# Altium schematic sheet 放大电路.SchDoc
size A4
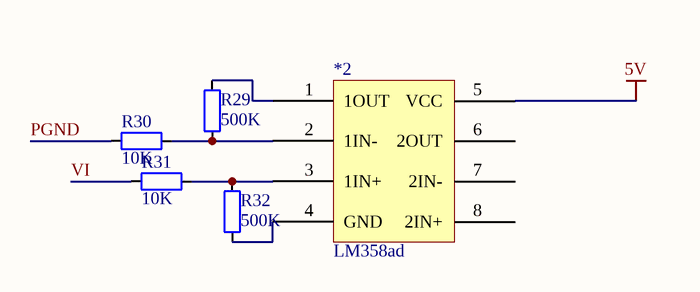
[diagram p0: 放大电路.SchDoc]

## Parts
*2  LM358ad  [SOP_E150_8]
R29  value 500K  [RES_0603]  (hidden comment: Res_0603)
R30  value 10K  [RES_0603]  (hidden comment: Res_0603)
R31  value 10K  [RES_0603]  (hidden comment: Res_0603)
R32  value 500K  [RES_0603]  (hidden comment: Res_0603)

## Nets
5V: *2.5(VCC)
PGND: R30.1
VI: R31.1
Net*2_1: *2.1(1OUT) R29.2
Net*2_2: *2.2(1IN-) R29.1 R30.2
Net*2_3: *2.3(1IN+) R31.2 R32.2
Net*2_4: *2.4(GND) R32.1

Not connected (* = marked no-connect by the designer): *2 6(2OUT) 7(2IN-) 8(2IN+)

## Library data of the parts
R29-R32 = Res_0603: Resistor